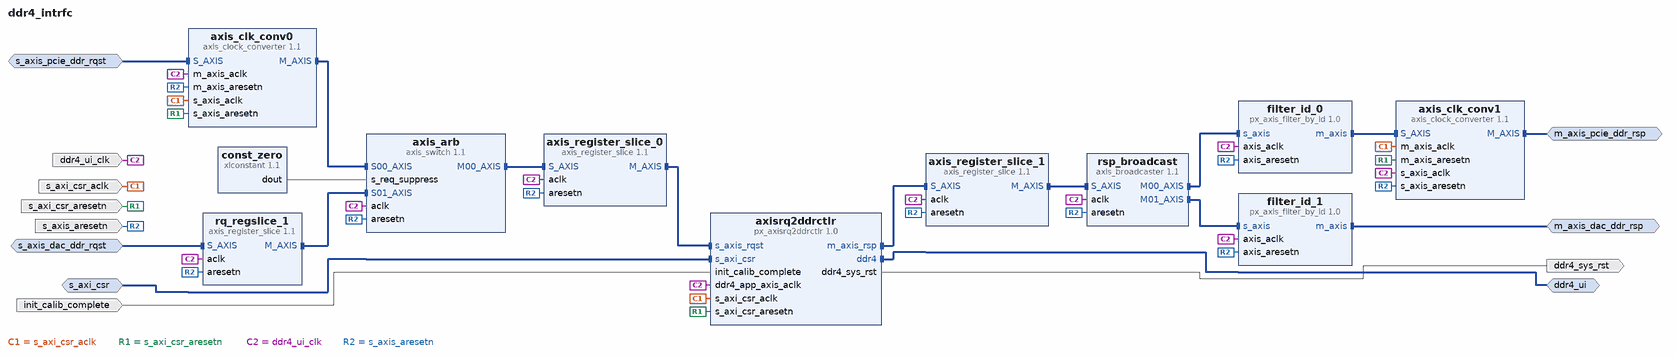
[diagram p0: block diagram of the top level]
# Vivado block design ddr4_intrfc, xcku060-ffva1156-2-e, Vivado 2017.2
create_bd_design ddr4_intrfc

create_bd_intf_port -mode Master -vlnv xilinx.com:interface:axis_rtl:1.0 m_axis_pcie_ddr_rsp
set_property -dict {CONFIG.FREQ_HZ 250000000 CONFIG.CLK_DOMAIN ddr4_intrfc_s_axi_csr_aclk} [get_bd_intf_ports m_axis_pcie_ddr_rsp]
create_bd_intf_port -mode Slave -vlnv xilinx.com:interface:axis_rtl:1.0 s_axis_pcie_ddr_rqst
set_property -dict [list \
  CONFIG.TDATA_NUM_BYTES 64 \
  CONFIG.TDEST_WIDTH 0 \
  CONFIG.TID_WIDTH 8 \
  CONFIG.TUSER_WIDTH 256 \
  CONFIG.HAS_TREADY 1 \
  CONFIG.HAS_TSTRB 0 \
  CONFIG.HAS_TKEEP 0 \
  CONFIG.HAS_TLAST 1 \
  CONFIG.FREQ_HZ 250000000 \
  CONFIG.PHASE 0.000 \
  CONFIG.CLK_DOMAIN ddr4_intrfc_s_axi_csr_aclk \
  CONFIG.LAYERED_METADATA undef \
] [get_bd_intf_ports s_axis_pcie_ddr_rqst]
create_bd_intf_port -mode Slave -vlnv xilinx.com:interface:aximm_rtl:1.0 s_axi_csr
set_property -dict [list \
  CONFIG.DATA_WIDTH 32 \
  CONFIG.PROTOCOL AXI4LITE \
  CONFIG.FREQ_HZ 250000000 \
  CONFIG.ID_WIDTH 0 \
  CONFIG.ADDR_WIDTH 26 \
  CONFIG.AWUSER_WIDTH 0 \
  CONFIG.ARUSER_WIDTH 0 \
  CONFIG.WUSER_WIDTH 0 \
  CONFIG.RUSER_WIDTH 0 \
  CONFIG.BUSER_WIDTH 0 \
  CONFIG.READ_WRITE_MODE READ_WRITE \
  CONFIG.HAS_BURST 0 \
  CONFIG.HAS_LOCK 0 \
  CONFIG.HAS_PROT 1 \
  CONFIG.HAS_CACHE 0 \
  CONFIG.HAS_QOS 0 \
  CONFIG.HAS_REGION 0 \
  CONFIG.HAS_WSTRB 1 \
  CONFIG.HAS_BRESP 1 \
  CONFIG.HAS_RRESP 1 \
  CONFIG.SUPPORTS_NARROW_BURST 0 \
  CONFIG.NUM_READ_OUTSTANDING 1 \
  CONFIG.NUM_WRITE_OUTSTANDING 1 \
  CONFIG.MAX_BURST_LENGTH 1 \
  CONFIG.PHASE 0.000 \
  CONFIG.CLK_DOMAIN ddr4_intrfc_s_axi_csr_aclk \
  CONFIG.NUM_READ_THREADS 1 \
  CONFIG.NUM_WRITE_THREADS 1 \
  CONFIG.RUSER_BITS_PER_BYTE 0 \
  CONFIG.WUSER_BITS_PER_BYTE 0 \
] [get_bd_intf_ports s_axi_csr]
create_bd_intf_port -mode Master -vlnv pentek.com:px_ip:ddr_ui_rtl:1.0 ddr4_ui
create_bd_intf_port -mode Slave -vlnv xilinx.com:interface:axis_rtl:1.0 s_axis_dac_ddr_rqst
set_property -dict [list \
  CONFIG.TDATA_NUM_BYTES 64 \
  CONFIG.TDEST_WIDTH 0 \
  CONFIG.TID_WIDTH 8 \
  CONFIG.TUSER_WIDTH 256 \
  CONFIG.HAS_TREADY 1 \
  CONFIG.HAS_TSTRB 0 \
  CONFIG.HAS_TKEEP 0 \
  CONFIG.HAS_TLAST 1 \
  CONFIG.FREQ_HZ 300000000 \
  CONFIG.PHASE 0.000 \
  CONFIG.LAYERED_METADATA undef \
] [get_bd_intf_ports s_axis_dac_ddr_rqst]
create_bd_intf_port -mode Master -vlnv xilinx.com:interface:axis_rtl:1.0 m_axis_dac_ddr_rsp
set_property -dict {CONFIG.FREQ_HZ 300000000} [get_bd_intf_ports m_axis_dac_ddr_rsp]
create_bd_port -dir I -type clk s_axi_csr_aclk
set_property -dict [list \
  CONFIG.FREQ_HZ 250000000 \
  CONFIG.CLK_DOMAIN ddr4_intrfc_s_axi_csr_aclk \
  CONFIG.ASSOCIATED_BUSIF s_axis_pcie_ddr_rqst:m_axis_pcie_ddr_rsp:s_axi_csr:s_axis_dac_ddr_rqst \
  CONFIG.ASSOCIATED_RESET s_axi_csr_aresetn \
] [get_bd_ports s_axi_csr_aclk]
create_bd_port -dir I -type rst s_axi_csr_aresetn
create_bd_port -dir I -type clk ddr4_ui_clk
set_property -dict [list \
  CONFIG.FREQ_HZ 300000000 \
  CONFIG.ASSOCIATED_BUSIF m_axis_dac_ddr_rsp:s_axis_dac_ddr_rqst \
] [get_bd_ports ddr4_ui_clk]
create_bd_port -dir I init_calib_complete
create_bd_port -dir O -type rst ddr4_sys_rst
create_bd_port -dir I -type rst s_axis_aresetn

create_bd_cell -type ip -vlnv xilinx.com:ip:xlconstant:1.1 const_zero
set_property -dict {CONFIG.CONST_WIDTH 2 CONFIG.CONST_VAL 0} [get_bd_cells const_zero]
create_bd_cell -type ip -vlnv xilinx.com:ip:axis_broadcaster:1.1 rsp_broadcast
set_property -dict [list \
  CONFIG.M00_TDATA_REMAP {tdata[511:0]} \
  CONFIG.M01_TDATA_REMAP {tdata[511:0]} \
  CONFIG.M00_TUSER_REMAP {tuser[255:0]} \
  CONFIG.M01_TUSER_REMAP {tuser[255:0]} \
] [get_bd_cells rsp_broadcast]
create_bd_cell -type ip -vlnv xilinx.com:ip:axis_clock_converter:1.1 axis_clk_conv1
create_bd_cell -type ip -vlnv xilinx.com:ip:axis_clock_converter:1.1 axis_clk_conv0
create_bd_cell -type ip -vlnv xilinx.com:ip:axis_switch:1.1 axis_arb
set_property -dict [list \
  CONFIG.TDATA_NUM_BYTES 64 \
  CONFIG.HAS_TLAST 1 \
  CONFIG.TID_WIDTH 8 \
  CONFIG.TUSER_WIDTH 256 \
  CONFIG.ARB_ON_MAX_XFERS 0 \
  CONFIG.ARB_ON_TLAST 1 \
  CONFIG.ARB_ALGORITHM 3 \
] [get_bd_cells axis_arb]
create_bd_cell -type ip -vlnv pentek.com:px_ip:px_axis_filter_by_id:1.0 filter_id_1
set_property -dict [list \
  CONFIG.id_filter_val 1 \
  CONFIG.has_tkeep false \
  CONFIG.tdata_bytes 64 \
  CONFIG.tuser_size 256 \
] [get_bd_cells filter_id_1]
create_bd_cell -type ip -vlnv pentek.com:px_ip:px_axis_filter_by_id:1.0 filter_id_0
set_property -dict {CONFIG.has_tkeep false CONFIG.tdata_bytes 64 CONFIG.tuser_size 256} [get_bd_cells filter_id_0]
create_bd_cell -type ip -vlnv pentek.com:px_ip:px_axisrq2ddrctlr:1.0 axisrq2ddrctlr
create_bd_cell -type ip -vlnv xilinx.com:ip:axis_register_slice:1.1 rq_regslice_1
create_bd_cell -type ip -vlnv xilinx.com:ip:axis_register_slice:1.1 axis_register_slice_0
create_bd_cell -type ip -vlnv xilinx.com:ip:axis_register_slice:1.1 axis_register_slice_1

# ---- connections ----

connect_bd_intf_net [get_bd_intf_pins rq_regslice_1/M_AXIS] [get_bd_intf_pins axis_arb/S01_AXIS]
connect_bd_intf_net [get_bd_intf_pins axis_clk_conv0/M_AXIS] [get_bd_intf_pins axis_arb/S00_AXIS]
connect_bd_intf_net [get_bd_intf_pins rsp_broadcast/M00_AXIS] [get_bd_intf_pins filter_id_0/s_axis]
connect_bd_intf_net [get_bd_intf_pins rsp_broadcast/M01_AXIS] [get_bd_intf_pins filter_id_1/s_axis]
connect_bd_intf_net [get_bd_intf_pins filter_id_0/m_axis] [get_bd_intf_pins axis_clk_conv1/S_AXIS]
connect_bd_intf_net [get_bd_intf_pins axis_arb/M00_AXIS] [get_bd_intf_pins axis_register_slice_0/S_AXIS]
connect_bd_intf_net [get_bd_intf_pins axisrq2ddrctlr/s_axis_rqst] [get_bd_intf_pins axis_register_slice_0/M_AXIS]
connect_bd_intf_net [get_bd_intf_pins axisrq2ddrctlr/m_axis_rsp] [get_bd_intf_pins axis_register_slice_1/S_AXIS]
connect_bd_intf_net [get_bd_intf_pins axis_register_slice_1/M_AXIS] [get_bd_intf_pins rsp_broadcast/S_AXIS]
connect_bd_intf_net [get_bd_intf_ports m_axis_pcie_ddr_rsp] [get_bd_intf_pins axis_clk_conv1/M_AXIS]
connect_bd_intf_net [get_bd_intf_ports s_axis_pcie_ddr_rqst] [get_bd_intf_pins axis_clk_conv0/S_AXIS]
connect_bd_intf_net [get_bd_intf_ports s_axi_csr] [get_bd_intf_pins axisrq2ddrctlr/s_axi_csr]
connect_bd_intf_net [get_bd_intf_ports ddr4_ui] [get_bd_intf_pins axisrq2ddrctlr/ddr4]
connect_bd_intf_net [get_bd_intf_ports s_axis_dac_ddr_rqst] [get_bd_intf_pins rq_regslice_1/S_AXIS]
connect_bd_intf_net [get_bd_intf_ports m_axis_dac_ddr_rsp] [get_bd_intf_pins filter_id_1/m_axis]
connect_bd_net [get_bd_pins const_zero/dout] [get_bd_pins axis_arb/s_req_suppress]
connect_bd_net -net s_axis_aclk_1 [get_bd_ports s_axi_csr_aclk] \
  [get_bd_pins axis_clk_conv1/m_axis_aclk] [get_bd_pins axis_clk_conv0/s_axis_aclk] \
  [get_bd_pins axisrq2ddrctlr/s_axi_csr_aclk]
connect_bd_net -net s_axis_aresetn_1 [get_bd_ports s_axi_csr_aresetn] \
  [get_bd_pins axis_clk_conv1/m_axis_aresetn] [get_bd_pins axis_clk_conv0/s_axis_aresetn] \
  [get_bd_pins axisrq2ddrctlr/s_axi_csr_aresetn]
connect_bd_net [get_bd_ports ddr4_ui_clk] \
  [get_bd_pins rsp_broadcast/aclk] [get_bd_pins axis_clk_conv1/s_axis_aclk] [get_bd_pins axis_clk_conv0/m_axis_aclk] \
  [get_bd_pins axis_arb/aclk] [get_bd_pins filter_id_1/axis_aclk] [get_bd_pins filter_id_0/axis_aclk] \
  [get_bd_pins axisrq2ddrctlr/ddr4_app_axis_aclk] [get_bd_pins rq_regslice_1/aclk] [get_bd_pins axis_register_slice_0/aclk] \
  [get_bd_pins axis_register_slice_1/aclk]
connect_bd_net [get_bd_ports init_calib_complete] [get_bd_pins axisrq2ddrctlr/init_calib_complete]
connect_bd_net [get_bd_pins axisrq2ddrctlr/ddr4_sys_rst] [get_bd_ports ddr4_sys_rst]
connect_bd_net [get_bd_ports s_axis_aresetn] \
  [get_bd_pins rsp_broadcast/aresetn] [get_bd_pins axis_clk_conv1/s_axis_aresetn] [get_bd_pins axis_clk_conv0/m_axis_aresetn] \
  [get_bd_pins axis_arb/aresetn] [get_bd_pins filter_id_1/axis_aresetn] [get_bd_pins filter_id_0/axis_aresetn] \
  [get_bd_pins rq_regslice_1/aresetn] [get_bd_pins axis_register_slice_0/aresetn] [get_bd_pins axis_register_slice_1/aresetn]

# ---- address map ----
assign_bd_address -offset 0x0007000 -range 4K -target_address_space [get_bd_addr_spaces s_axi_csr] [get_bd_addr_segs axisrq2ddrctlr/s_axi_csr/reg0]

validate_bd_design
save_bd_design
